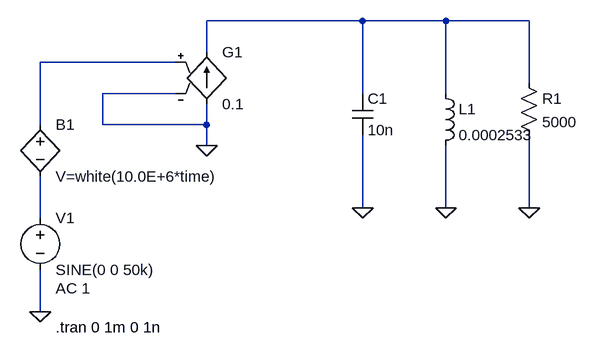
[diagram p0: schematic 3.asc]
3.asc, the LTspice schematic file:
Version 4
SHEET 1 880 680
WIRE 448 -80 208 -80
WIRE 576 -80 448 -80
WIRE 704 -80 576 -80
WIRE 208 -32 208 -80
WIRE 160 -16 -48 -16
WIRE 704 16 704 -80
WIRE 160 32 48 32
WIRE 448 32 448 -80
WIRE 576 32 576 -80
WIRE -48 80 -48 -16
WIRE 48 80 48 32
WIRE 208 80 208 48
WIRE 208 80 48 80
WIRE 208 112 208 80
WIRE 448 208 448 96
WIRE 576 208 576 112
WIRE 704 208 704 96
WIRE -48 224 -48 160
WIRE -48 368 -48 304
FLAG -48 368 0
FLAG 208 112 0
FLAG 448 208 0
FLAG 704 208 0
FLAG 576 208 0
SYMBOL voltage -48 208 R0
WINDOW 123 24 124 Left 2
WINDOW 39 0 0 Left 0
SYMATTR InstName V1
SYMATTR Value SINE(0 0 50k)
SYMATTR Value2 AC 1
SYMBOL bv -48 64 R0
SYMATTR InstName B1
SYMATTR Value V=white(10.0E+6*time)
SYMBOL g 208 -48 R0
SYMATTR InstName G1
SYMATTR Value 0.1
SYMBOL cap 432 32 R0
SYMATTR InstName C1
SYMATTR Value 10n
SYMBOL res 688 0 R0
SYMATTR InstName R1
SYMATTR Value 5000
SYMBOL ind 560 16 R0
SYMATTR InstName L1
SYMATTR Value 0.0002533
TEXT -24 392 Left 2 !.tran 0 1m 0 1n

The netlist it stands for:
* 3.asc
V1 N003 0 SINE(0 0 50k) AC 1
B1 N002 N003 V=white(10.0E+6*time)
G1 0 N001 N002 0 0.1
C1 N001 0 10n
R1 N001 0 5000
L1 N001 0 0.0002533
.tran 0 1m 0 1n
.backanno
.end